# EAGLE schematic Glasses (EAGLE 9.1.0)

## Sheet 1 of 9
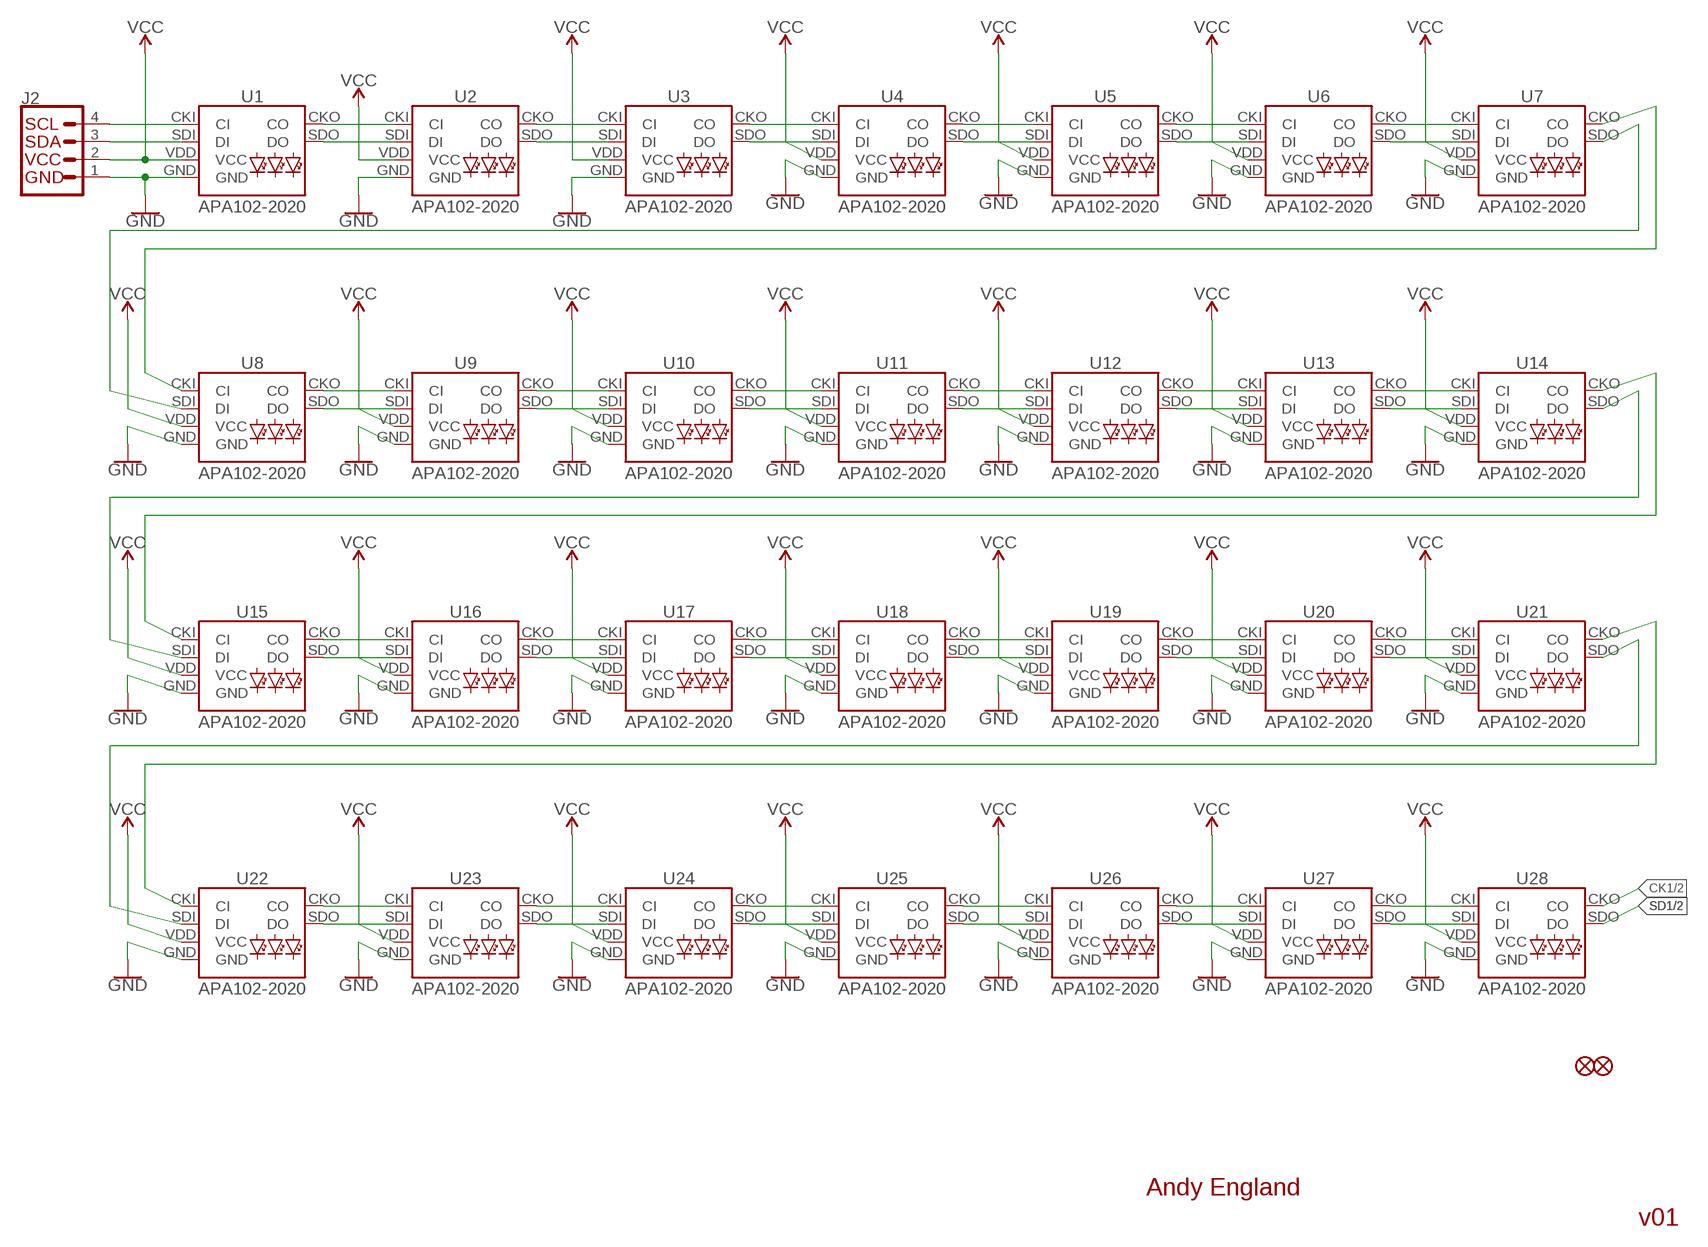
[diagram p0: schematic, sheet 1]

### Parts
FD1  FIDUCIALUFIDUCIAL  [FIDUCIAL-MICRO]
FD2  FIDUCIALUFIDUCIAL  [FIDUCIAL-MICRO]
J2  QWIIC_CONNECTORJS-1MM  [1X04_1MM_RA]
U1  APA102-2020  [APA102-2020]
U2  APA102-2020  [APA102-2020]
U3  APA102-2020  [APA102-2020]
U4  APA102-2020  [APA102-2020]
U5  APA102-2020  [APA102-2020]
U6  APA102-2020  [APA102-2020]
U7  APA102-2020  [APA102-2020]
U8  APA102-2020  [APA102-2020]
U9  APA102-2020  [APA102-2020]
U10  APA102-2020  [APA102-2020]
U11  APA102-2020  [APA102-2020]
U12  APA102-2020  [APA102-2020]
U13  APA102-2020  [APA102-2020]
U14  APA102-2020  [APA102-2020]
U15  APA102-2020  [APA102-2020]
U16  APA102-2020  [APA102-2020]
U17  APA102-2020  [APA102-2020]
U18  APA102-2020  [APA102-2020]
U19  APA102-2020  [APA102-2020]
U20  APA102-2020  [APA102-2020]
U21  APA102-2020  [APA102-2020]
U22  APA102-2020  [APA102-2020]
U23  APA102-2020  [APA102-2020]
U24  APA102-2020  [APA102-2020]
U25  APA102-2020  [APA102-2020]
U26  APA102-2020  [APA102-2020]
U27  APA102-2020  [APA102-2020]
U28  APA102-2020  [APA102-2020]

### Nets
CK1: U28.CKO(CO) ; also sheet 2
GND: J2.1 U1.GND U2.GND U3.GND U4.GND U5.GND U6.GND U7.GND U8.GND U9.GND U10.GND U11.GND U12.GND U13.GND U14.GND U15.GND U16.GND U17.GND U18.GND U19.GND U20.GND U21.GND U22.GND U23.GND U24.GND U25.GND U26.GND U27.GND U28.GND ; also sheet 2,3,4,5,6,7,8,9
N$1: U1.SDO(DO) U2.SDI(DI)
N$2: U1.CKO(CO) U2.CKI(CI)
N$3: U2.CKO(CO) U3.CKI(CI)
N$4: U2.SDO(DO) U3.SDI(DI)
N$5: U3.SDO(DO) U4.SDI(DI)
N$6: U3.CKO(CO) U4.CKI(CI)
N$7: U4.CKO(CO) U5.CKI(CI)
N$8: U4.SDO(DO) U5.SDI(DI)
N$9: U5.CKO(CO) U6.CKI(CI)
N$10: U5.SDO(DO) U6.SDI(DI)
N$11: U6.CKO(CO) U7.CKI(CI)
N$12: U6.SDO(DO) U7.SDI(DI)
N$13: U8.SDO(DO) U9.SDI(DI)
N$14: U8.CKO(CO) U9.CKI(CI)
N$15: U9.CKO(CO) U10.CKI(CI)
N$16: U9.SDO(DO) U10.SDI(DI)
N$17: U10.SDO(DO) U11.SDI(DI)
N$18: U10.CKO(CO) U11.CKI(CI)
N$19: U11.CKO(CO) U12.CKI(CI)
N$20: U11.SDO(DO) U12.SDI(DI)
N$21: U12.CKO(CO) U13.CKI(CI)
N$22: U12.SDO(DO) U13.SDI(DI)
N$23: U13.CKO(CO) U14.CKI(CI)
N$24: U13.SDO(DO) U14.SDI(DI)
N$25: U7.SDO(DO) U8.SDI(DI)
N$26: U7.CKO(CO) U8.CKI(CI)
N$27: U15.SDO(DO) U16.SDI(DI)
N$28: U15.CKO(CO) U16.CKI(CI)
N$29: U16.CKO(CO) U17.CKI(CI)
N$30: U16.SDO(DO) U17.SDI(DI)
N$31: U17.SDO(DO) U18.SDI(DI)
N$32: U17.CKO(CO) U18.CKI(CI)
N$33: U18.CKO(CO) U19.CKI(CI)
N$34: U18.SDO(DO) U19.SDI(DI)
N$35: U19.CKO(CO) U20.CKI(CI)
N$36: U19.SDO(DO) U20.SDI(DI)
N$37: U20.CKO(CO) U21.CKI(CI)
N$38: U20.SDO(DO) U21.SDI(DI)
N$39: U22.SDO(DO) U23.SDI(DI)
N$40: U22.CKO(CO) U23.CKI(CI)
N$41: U23.CKO(CO) U24.CKI(CI)
N$42: U23.SDO(DO) U24.SDI(DI)
N$43: U24.SDO(DO) U25.SDI(DI)
N$44: U24.CKO(CO) U25.CKI(CI)
N$45: U25.CKO(CO) U26.CKI(CI)
N$46: U25.SDO(DO) U26.SDI(DI)
N$47: U26.CKO(CO) U27.CKI(CI)
N$48: U26.SDO(DO) U27.SDI(DI)
N$49: U27.CKO(CO) U28.CKI(CI)
N$50: U27.SDO(DO) U28.SDI(DI)
N$51: U21.SDO(DO) U22.SDI(DI)
N$52: U21.CKO(CO) U22.CKI(CI)
N$53: U14.SDO(DO) U15.SDI(DI)
N$54: U14.CKO(CO) U15.CKI(CI)
N$270: J2.3 U1.SDI(DI)
N$490: J2.4 U1.CKI(CI)
SD1: U28.SDO(DO) ; also sheet 2
VCC: J2.2 U1.VDD(VCC) U2.VDD(VCC) U3.VDD(VCC) U4.VDD(VCC) U5.VDD(VCC) U6.VDD(VCC) U7.VDD(VCC) U8.VDD(VCC) U9.VDD(VCC) U10.VDD(VCC) U11.VDD(VCC) U12.VDD(VCC) U13.VDD(VCC) U14.VDD(VCC) U15.VDD(VCC) U16.VDD(VCC) U17.VDD(VCC) U18.VDD(VCC) U19.VDD(VCC) U20.VDD(VCC) U21.VDD(VCC) U22.VDD(VCC) U23.VDD(VCC) U24.VDD(VCC) U25.VDD(VCC) U26.VDD(VCC) U27.VDD(VCC) U28.VDD(VCC) ; also sheet 2,3,4,5,6,7,8,9

### Notes on the sheet
- Andy England
- v01

## Sheet 2 of 9
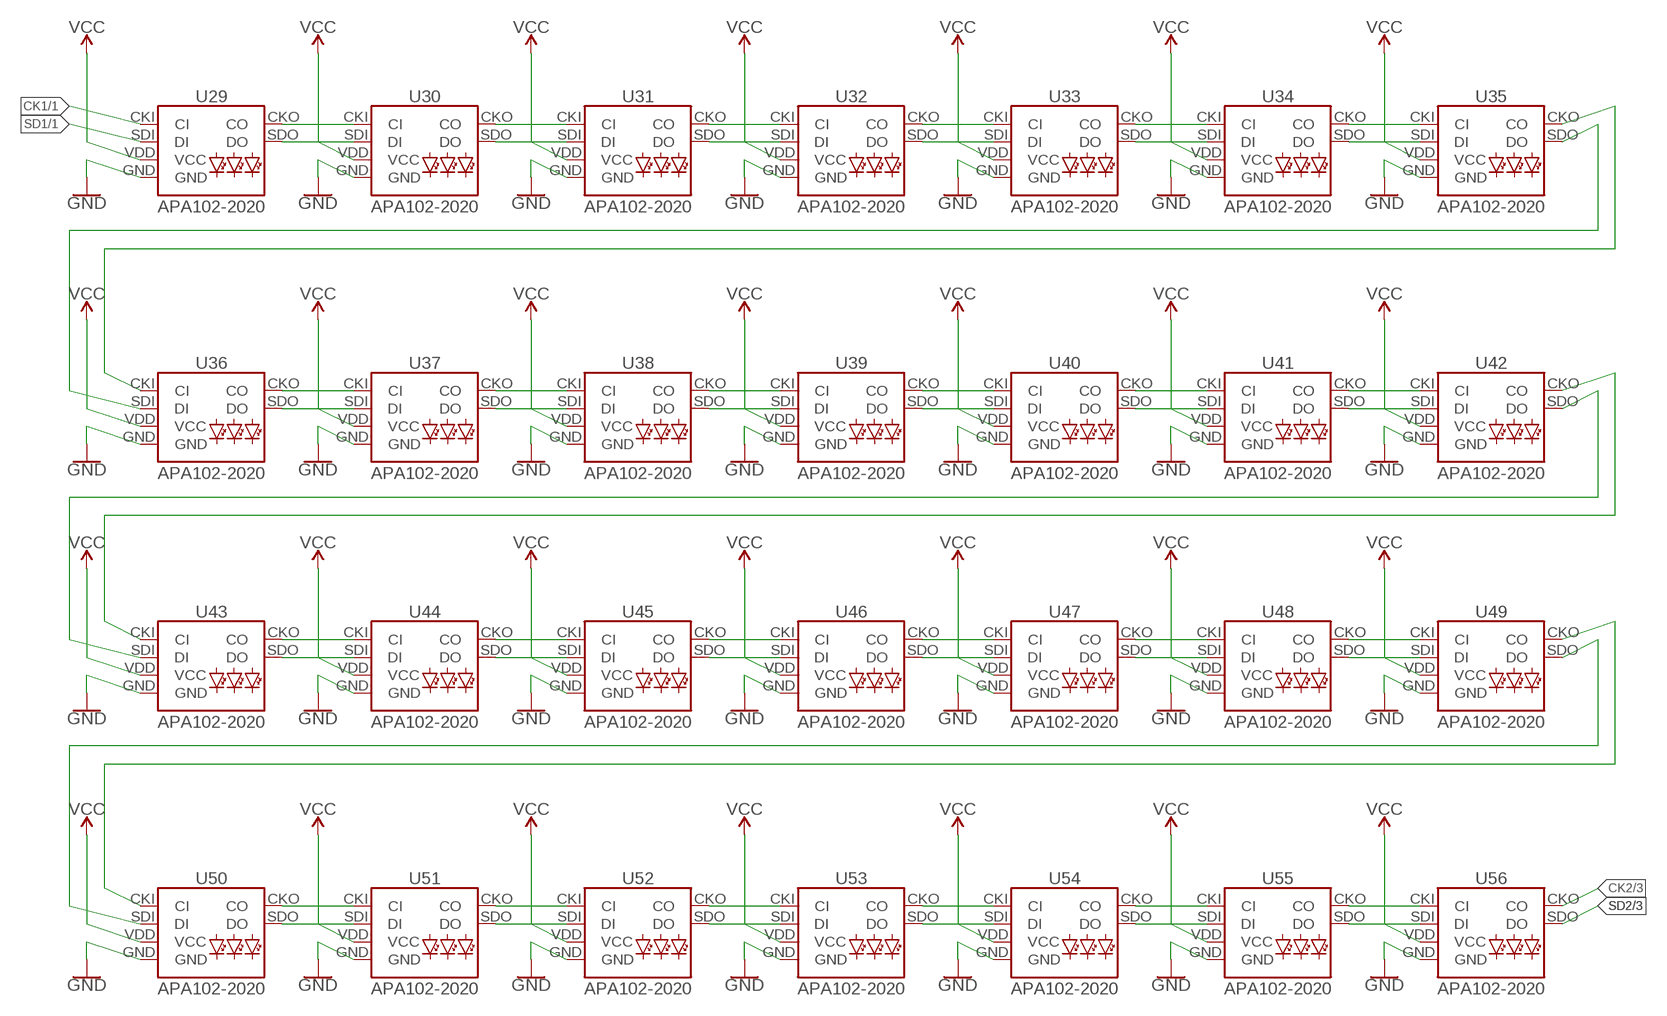
[diagram p1: schematic, sheet 2]

### Parts
U29  APA102-2020  [APA102-2020]
U30  APA102-2020  [APA102-2020]
U31  APA102-2020  [APA102-2020]
U32  APA102-2020  [APA102-2020]
U33  APA102-2020  [APA102-2020]
U34  APA102-2020  [APA102-2020]
U35  APA102-2020  [APA102-2020]
U36  APA102-2020  [APA102-2020]
U37  APA102-2020  [APA102-2020]
U38  APA102-2020  [APA102-2020]
U39  APA102-2020  [APA102-2020]
U40  APA102-2020  [APA102-2020]
U41  APA102-2020  [APA102-2020]
U42  APA102-2020  [APA102-2020]
U43  APA102-2020  [APA102-2020]
U44  APA102-2020  [APA102-2020]
U45  APA102-2020  [APA102-2020]
U46  APA102-2020  [APA102-2020]
U47  APA102-2020  [APA102-2020]
U48  APA102-2020  [APA102-2020]
U49  APA102-2020  [APA102-2020]
U50  APA102-2020  [APA102-2020]
U51  APA102-2020  [APA102-2020]
U52  APA102-2020  [APA102-2020]
U53  APA102-2020  [APA102-2020]
U54  APA102-2020  [APA102-2020]
U55  APA102-2020  [APA102-2020]
U56  APA102-2020  [APA102-2020]

### Nets
CK1: U29.CKI(CI) ; also sheet 1
CK2: U56.CKO(CO) ; also sheet 3
GND: U29.GND U30.GND U31.GND U32.GND U33.GND U34.GND U35.GND U36.GND U37.GND U38.GND U39.GND U40.GND U41.GND U42.GND U43.GND U44.GND U45.GND U46.GND U47.GND U48.GND U49.GND U50.GND U51.GND U52.GND U53.GND U54.GND U55.GND U56.GND ; also sheet 1,3,4,5,6,7,8,9
N$55: U29.SDO(DO) U30.SDI(DI)
N$56: U29.CKO(CO) U30.CKI(CI)
N$57: U30.CKO(CO) U31.CKI(CI)
N$58: U30.SDO(DO) U31.SDI(DI)
N$59: U31.SDO(DO) U32.SDI(DI)
N$60: U31.CKO(CO) U32.CKI(CI)
N$61: U32.CKO(CO) U33.CKI(CI)
N$62: U32.SDO(DO) U33.SDI(DI)
N$63: U33.CKO(CO) U34.CKI(CI)
N$64: U33.SDO(DO) U34.SDI(DI)
N$65: U34.CKO(CO) U35.CKI(CI)
N$66: U34.SDO(DO) U35.SDI(DI)
N$67: U36.SDO(DO) U37.SDI(DI)
N$68: U36.CKO(CO) U37.CKI(CI)
N$69: U37.CKO(CO) U38.CKI(CI)
N$70: U37.SDO(DO) U38.SDI(DI)
N$71: U38.SDO(DO) U39.SDI(DI)
N$72: U38.CKO(CO) U39.CKI(CI)
N$73: U39.CKO(CO) U40.CKI(CI)
N$74: U39.SDO(DO) U40.SDI(DI)
N$75: U40.CKO(CO) U41.CKI(CI)
N$76: U40.SDO(DO) U41.SDI(DI)
N$77: U41.CKO(CO) U42.CKI(CI)
N$78: U41.SDO(DO) U42.SDI(DI)
N$79: U35.SDO(DO) U36.SDI(DI)
N$80: U35.CKO(CO) U36.CKI(CI)
N$81: U43.SDO(DO) U44.SDI(DI)
N$82: U43.CKO(CO) U44.CKI(CI)
N$83: U44.CKO(CO) U45.CKI(CI)
N$84: U44.SDO(DO) U45.SDI(DI)
N$85: U45.SDO(DO) U46.SDI(DI)
N$86: U45.CKO(CO) U46.CKI(CI)
N$87: U46.CKO(CO) U47.CKI(CI)
N$88: U46.SDO(DO) U47.SDI(DI)
N$89: U47.CKO(CO) U48.CKI(CI)
N$90: U47.SDO(DO) U48.SDI(DI)
N$91: U48.CKO(CO) U49.CKI(CI)
N$92: U48.SDO(DO) U49.SDI(DI)
N$93: U50.SDO(DO) U51.SDI(DI)
N$94: U50.CKO(CO) U51.CKI(CI)
N$95: U51.CKO(CO) U52.CKI(CI)
N$96: U51.SDO(DO) U52.SDI(DI)
N$97: U52.SDO(DO) U53.SDI(DI)
N$98: U52.CKO(CO) U53.CKI(CI)
N$99: U53.CKO(CO) U54.CKI(CI)
N$100: U53.SDO(DO) U54.SDI(DI)
N$101: U54.CKO(CO) U55.CKI(CI)
N$102: U54.SDO(DO) U55.SDI(DI)
N$103: U55.CKO(CO) U56.CKI(CI)
N$104: U55.SDO(DO) U56.SDI(DI)
N$105: U49.SDO(DO) U50.SDI(DI)
N$106: U49.CKO(CO) U50.CKI(CI)
N$107: U42.SDO(DO) U43.SDI(DI)
N$108: U42.CKO(CO) U43.CKI(CI)
SD1: U29.SDI(DI) ; also sheet 1
SD2: U56.SDO(DO) ; also sheet 3
VCC: U29.VDD(VCC) U30.VDD(VCC) U31.VDD(VCC) U32.VDD(VCC) U33.VDD(VCC) U34.VDD(VCC) U35.VDD(VCC) U36.VDD(VCC) U37.VDD(VCC) U38.VDD(VCC) U39.VDD(VCC) U40.VDD(VCC) U41.VDD(VCC) U42.VDD(VCC) U43.VDD(VCC) U44.VDD(VCC) U45.VDD(VCC) U46.VDD(VCC) U47.VDD(VCC) U48.VDD(VCC) U49.VDD(VCC) U50.VDD(VCC) U51.VDD(VCC) U52.VDD(VCC) U53.VDD(VCC) U54.VDD(VCC) U55.VDD(VCC) U56.VDD(VCC) ; also sheet 1,3,4,5,6,7,8,9

## Sheet 3 of 9
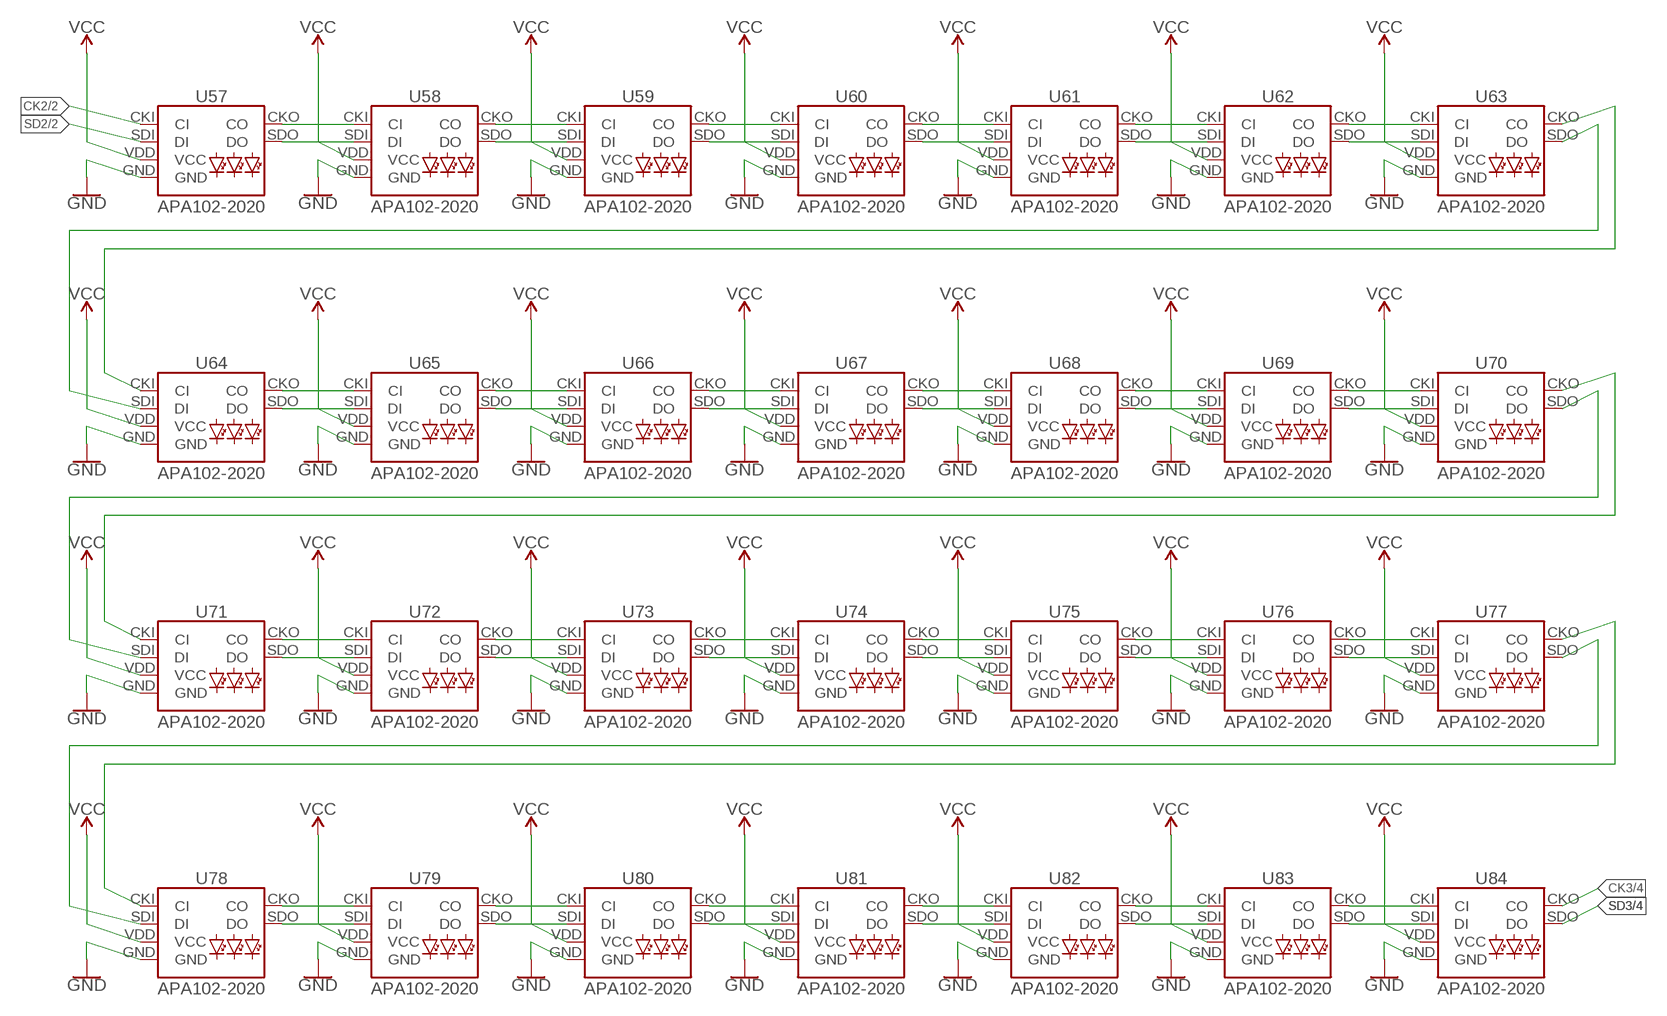
[diagram p2: schematic, sheet 3]

### Parts
U57  APA102-2020  [APA102-2020]
U58  APA102-2020  [APA102-2020]
U59  APA102-2020  [APA102-2020]
U60  APA102-2020  [APA102-2020]
U61  APA102-2020  [APA102-2020]
U62  APA102-2020  [APA102-2020]
U63  APA102-2020  [APA102-2020]
U64  APA102-2020  [APA102-2020]
U65  APA102-2020  [APA102-2020]
U66  APA102-2020  [APA102-2020]
U67  APA102-2020  [APA102-2020]
U68  APA102-2020  [APA102-2020]
U69  APA102-2020  [APA102-2020]
U70  APA102-2020  [APA102-2020]
U71  APA102-2020  [APA102-2020]
U72  APA102-2020  [APA102-2020]
U73  APA102-2020  [APA102-2020]
U74  APA102-2020  [APA102-2020]
U75  APA102-2020  [APA102-2020]
U76  APA102-2020  [APA102-2020]
U77  APA102-2020  [APA102-2020]
U78  APA102-2020  [APA102-2020]
U79  APA102-2020  [APA102-2020]
U80  APA102-2020  [APA102-2020]
U81  APA102-2020  [APA102-2020]
U82  APA102-2020  [APA102-2020]
U83  APA102-2020  [APA102-2020]
U84  APA102-2020  [APA102-2020]

### Nets
CK2: U57.CKI(CI) ; also sheet 2
CK3: U84.CKO(CO) ; also sheet 4
GND: U57.GND U58.GND U59.GND U60.GND U61.GND U62.GND U63.GND U64.GND U65.GND U66.GND U67.GND U68.GND U69.GND U70.GND U71.GND U72.GND U73.GND U74.GND U75.GND U76.GND U77.GND U78.GND U79.GND U80.GND U81.GND U82.GND U83.GND U84.GND ; also sheet 1,2,4,5,6,7,8,9
N$109: U57.SDO(DO) U58.SDI(DI)
N$110: U57.CKO(CO) U58.CKI(CI)
N$111: U58.CKO(CO) U59.CKI(CI)
N$112: U58.SDO(DO) U59.SDI(DI)
N$113: U59.SDO(DO) U60.SDI(DI)
N$114: U59.CKO(CO) U60.CKI(CI)
N$115: U60.CKO(CO) U61.CKI(CI)
N$116: U60.SDO(DO) U61.SDI(DI)
N$117: U61.CKO(CO) U62.CKI(CI)
N$118: U61.SDO(DO) U62.SDI(DI)
N$119: U62.CKO(CO) U63.CKI(CI)
N$120: U62.SDO(DO) U63.SDI(DI)
N$121: U64.SDO(DO) U65.SDI(DI)
N$122: U64.CKO(CO) U65.CKI(CI)
N$123: U65.CKO(CO) U66.CKI(CI)
N$124: U65.SDO(DO) U66.SDI(DI)
N$125: U66.SDO(DO) U67.SDI(DI)
N$126: U66.CKO(CO) U67.CKI(CI)
N$127: U67.CKO(CO) U68.CKI(CI)
N$128: U67.SDO(DO) U68.SDI(DI)
N$129: U68.CKO(CO) U69.CKI(CI)
N$130: U68.SDO(DO) U69.SDI(DI)
N$131: U69.CKO(CO) U70.CKI(CI)
N$132: U69.SDO(DO) U70.SDI(DI)
N$133: U63.SDO(DO) U64.SDI(DI)
N$134: U63.CKO(CO) U64.CKI(CI)
N$135: U71.SDO(DO) U72.SDI(DI)
N$136: U71.CKO(CO) U72.CKI(CI)
N$137: U72.CKO(CO) U73.CKI(CI)
N$138: U72.SDO(DO) U73.SDI(DI)
N$139: U73.SDO(DO) U74.SDI(DI)
N$140: U73.CKO(CO) U74.CKI(CI)
N$141: U74.CKO(CO) U75.CKI(CI)
N$142: U74.SDO(DO) U75.SDI(DI)
N$143: U75.CKO(CO) U76.CKI(CI)
N$144: U75.SDO(DO) U76.SDI(DI)
N$145: U76.CKO(CO) U77.CKI(CI)
N$146: U76.SDO(DO) U77.SDI(DI)
N$147: U78.SDO(DO) U79.SDI(DI)
N$148: U78.CKO(CO) U79.CKI(CI)
N$149: U79.CKO(CO) U80.CKI(CI)
N$150: U79.SDO(DO) U80.SDI(DI)
N$151: U80.SDO(DO) U81.SDI(DI)
N$152: U80.CKO(CO) U81.CKI(CI)
N$153: U81.CKO(CO) U82.CKI(CI)
N$154: U81.SDO(DO) U82.SDI(DI)
N$155: U82.CKO(CO) U83.CKI(CI)
N$156: U82.SDO(DO) U83.SDI(DI)
N$157: U83.CKO(CO) U84.CKI(CI)
N$158: U83.SDO(DO) U84.SDI(DI)
N$159: U77.SDO(DO) U78.SDI(DI)
N$160: U77.CKO(CO) U78.CKI(CI)
N$161: U70.SDO(DO) U71.SDI(DI)
N$162: U70.CKO(CO) U71.CKI(CI)
SD2: U57.SDI(DI) ; also sheet 2
SD3: U84.SDO(DO) ; also sheet 4
VCC: U57.VDD(VCC) U58.VDD(VCC) U59.VDD(VCC) U60.VDD(VCC) U61.VDD(VCC) U62.VDD(VCC) U63.VDD(VCC) U64.VDD(VCC) U65.VDD(VCC) U66.VDD(VCC) U67.VDD(VCC) U68.VDD(VCC) U69.VDD(VCC) U70.VDD(VCC) U71.VDD(VCC) U72.VDD(VCC) U73.VDD(VCC) U74.VDD(VCC) U75.VDD(VCC) U76.VDD(VCC) U77.VDD(VCC) U78.VDD(VCC) U79.VDD(VCC) U80.VDD(VCC) U81.VDD(VCC) U82.VDD(VCC) U83.VDD(VCC) U84.VDD(VCC) ; also sheet 1,2,4,5,6,7,8,9

## Sheet 4 of 9
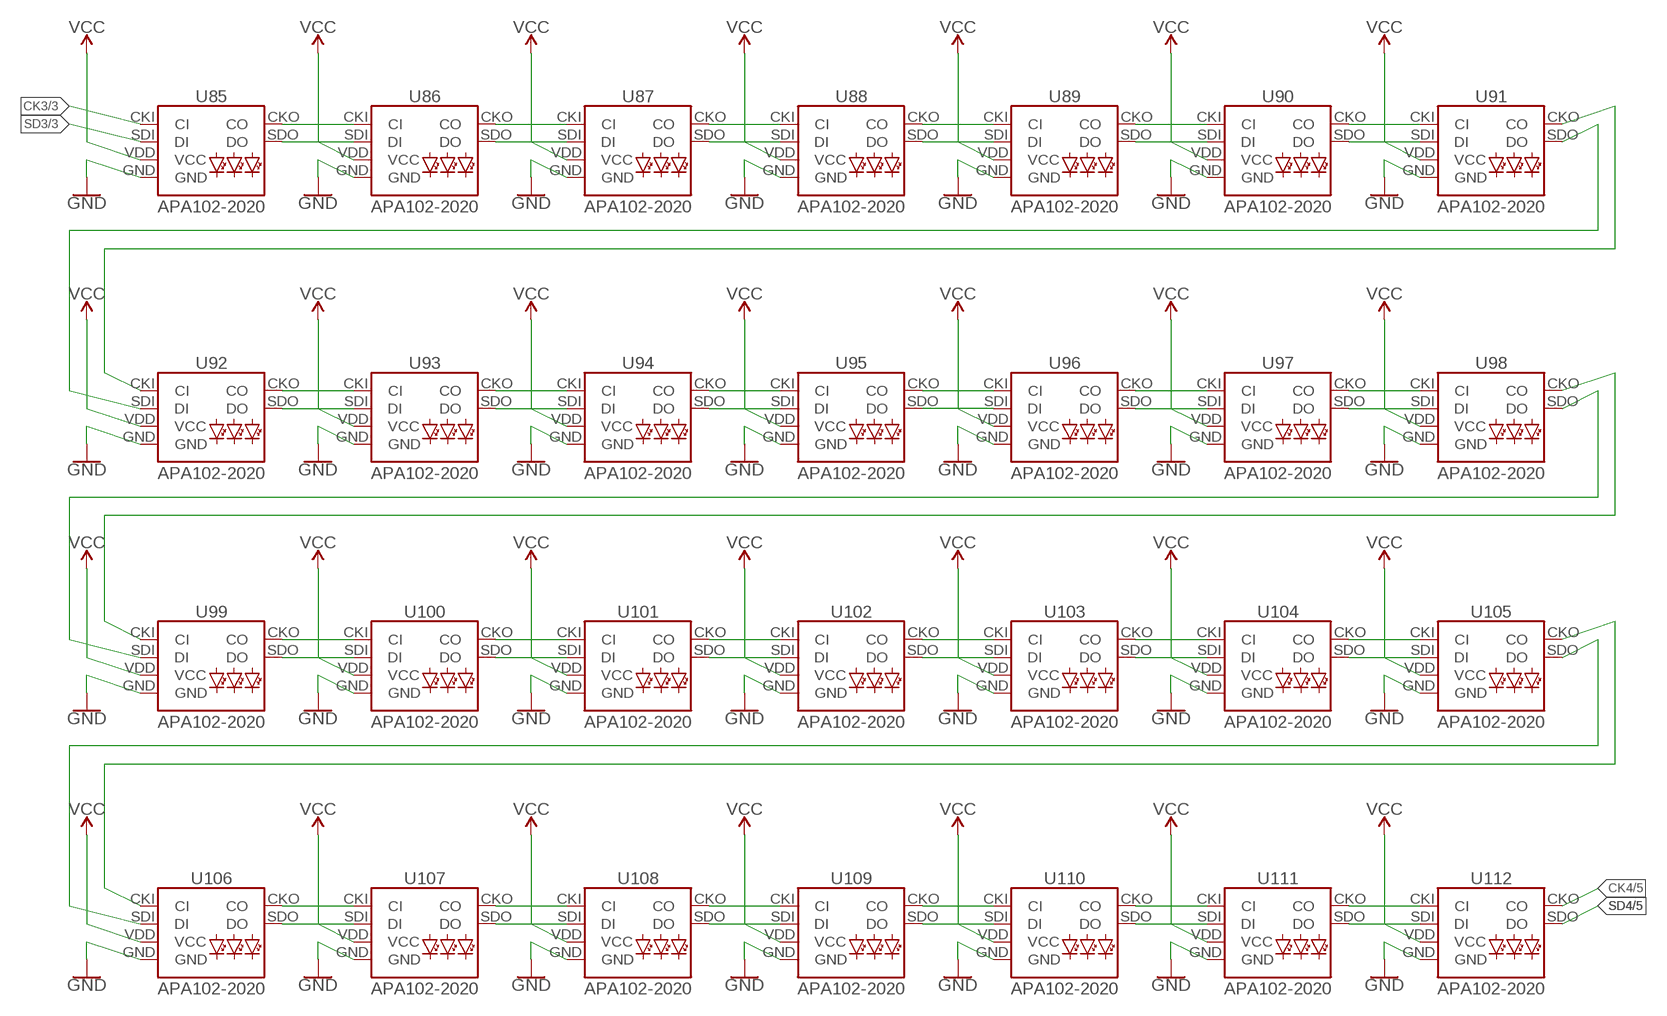
[diagram p3: schematic, sheet 4]

### Parts
U85  APA102-2020  [APA102-2020]
U86  APA102-2020  [APA102-2020]
U87  APA102-2020  [APA102-2020]
U88  APA102-2020  [APA102-2020]
U89  APA102-2020  [APA102-2020]
U90  APA102-2020  [APA102-2020]
U91  APA102-2020  [APA102-2020]
U92  APA102-2020  [APA102-2020]
U93  APA102-2020  [APA102-2020]
U94  APA102-2020  [APA102-2020]
U95  APA102-2020  [APA102-2020]
U96  APA102-2020  [APA102-2020]
U97  APA102-2020  [APA102-2020]
U98  APA102-2020  [APA102-2020]
U99  APA102-2020  [APA102-2020]
U100  APA102-2020  [APA102-2020]
U101  APA102-2020  [APA102-2020]
U102  APA102-2020  [APA102-2020]
U103  APA102-2020  [APA102-2020]
U104  APA102-2020  [APA102-2020]
U105  APA102-2020  [APA102-2020]
U106  APA102-2020  [APA102-2020]
U107  APA102-2020  [APA102-2020]
U108  APA102-2020  [APA102-2020]
U109  APA102-2020  [APA102-2020]
U110  APA102-2020  [APA102-2020]
U111  APA102-2020  [APA102-2020]
U112  APA102-2020  [APA102-2020]

### Nets
CK3: U85.CKI(CI) ; also sheet 3
CK4: U112.CKO(CO) ; also sheet 5
GND: U85.GND U86.GND U87.GND U88.GND U89.GND U90.GND U91.GND U92.GND U93.GND U94.GND U95.GND U96.GND U97.GND U98.GND U99.GND U100.GND U101.GND U102.GND U103.GND U104.GND U105.GND U106.GND U107.GND U108.GND U109.GND U110.GND U111.GND U112.GND ; also sheet 1,2,3,5,6,7,8,9
N$163: U85.SDO(DO) U86.SDI(DI)
N$164: U85.CKO(CO) U86.CKI(CI)
N$165: U86.CKO(CO) U87.CKI(CI)
N$166: U86.SDO(DO) U87.SDI(DI)
N$167: U87.SDO(DO) U88.SDI(DI)
N$168: U87.CKO(CO) U88.CKI(CI)
N$169: U88.CKO(CO) U89.CKI(CI)
N$170: U88.SDO(DO) U89.SDI(DI)
N$171: U89.CKO(CO) U90.CKI(CI)
N$172: U89.SDO(DO) U90.SDI(DI)
N$173: U90.CKO(CO) U91.CKI(CI)
N$174: U90.SDO(DO) U91.SDI(DI)
N$175: U92.SDO(DO) U93.SDI(DI)
N$176: U92.CKO(CO) U93.CKI(CI)
N$177: U93.CKO(CO) U94.CKI(CI)
N$178: U93.SDO(DO) U94.SDI(DI)
N$179: U94.SDO(DO) U95.SDI(DI)
N$180: U94.CKO(CO) U95.CKI(CI)
N$181: U95.SDO(DO) U96.SDI(DI)
N$182: U95.CKO(CO) U96.CKI(CI)
N$183: U96.CKO(CO) U97.CKI(CI)
N$184: U96.SDO(DO) U97.SDI(DI)
N$185: U97.CKO(CO) U98.CKI(CI)
N$186: U97.SDO(DO) U98.SDI(DI)
N$187: U91.SDO(DO) U92.SDI(DI)
N$188: U91.CKO(CO) U92.CKI(CI)
N$189: U99.SDO(DO) U100.SDI(DI)
N$190: U99.CKO(CO) U100.CKI(CI)
N$191: U100.CKO(CO) U101.CKI(CI)
N$192: U100.SDO(DO) U101.SDI(DI)
N$193: U101.SDO(DO) U102.SDI(DI)
N$194: U101.CKO(CO) U102.CKI(CI)
N$195: U102.CKO(CO) U103.CKI(CI)
N$196: U102.SDO(DO) U103.SDI(DI)
N$197: U103.CKO(CO) U104.CKI(CI)
N$198: U103.SDO(DO) U104.SDI(DI)
N$199: U104.CKO(CO) U105.CKI(CI)
N$200: U104.SDO(DO) U105.SDI(DI)
N$201: U106.SDO(DO) U107.SDI(DI)
N$202: U106.CKO(CO) U107.CKI(CI)
N$203: U107.CKO(CO) U108.CKI(CI)
N$204: U107.SDO(DO) U108.SDI(DI)
N$205: U108.SDO(DO) U109.SDI(DI)
N$206: U108.CKO(CO) U109.CKI(CI)
N$207: U109.CKO(CO) U110.CKI(CI)
N$208: U109.SDO(DO) U110.SDI(DI)
N$209: U110.CKO(CO) U111.CKI(CI)
N$210: U110.SDO(DO) U111.SDI(DI)
N$211: U111.CKO(CO) U112.CKI(CI)
N$212: U111.SDO(DO) U112.SDI(DI)
N$213: U105.SDO(DO) U106.SDI(DI)
N$214: U105.CKO(CO) U106.CKI(CI)
N$215: U98.SDO(DO) U99.SDI(DI)
N$216: U98.CKO(CO) U99.CKI(CI)
SD3: U85.SDI(DI) ; also sheet 3
SD4: U112.SDO(DO) ; also sheet 5
VCC: U85.VDD(VCC) U86.VDD(VCC) U87.VDD(VCC) U88.VDD(VCC) U89.VDD(VCC) U90.VDD(VCC) U91.VDD(VCC) U92.VDD(VCC) U93.VDD(VCC) U94.VDD(VCC) U95.VDD(VCC) U96.VDD(VCC) U97.VDD(VCC) U98.VDD(VCC) U99.VDD(VCC) U100.VDD(VCC) U101.VDD(VCC) U102.VDD(VCC) U103.VDD(VCC) U104.VDD(VCC) U105.VDD(VCC) U106.VDD(VCC) U107.VDD(VCC) U108.VDD(VCC) U109.VDD(VCC) U110.VDD(VCC) U111.VDD(VCC) U112.VDD(VCC) ; also sheet 1,2,3,5,6,7,8,9

## Sheet 5 of 9
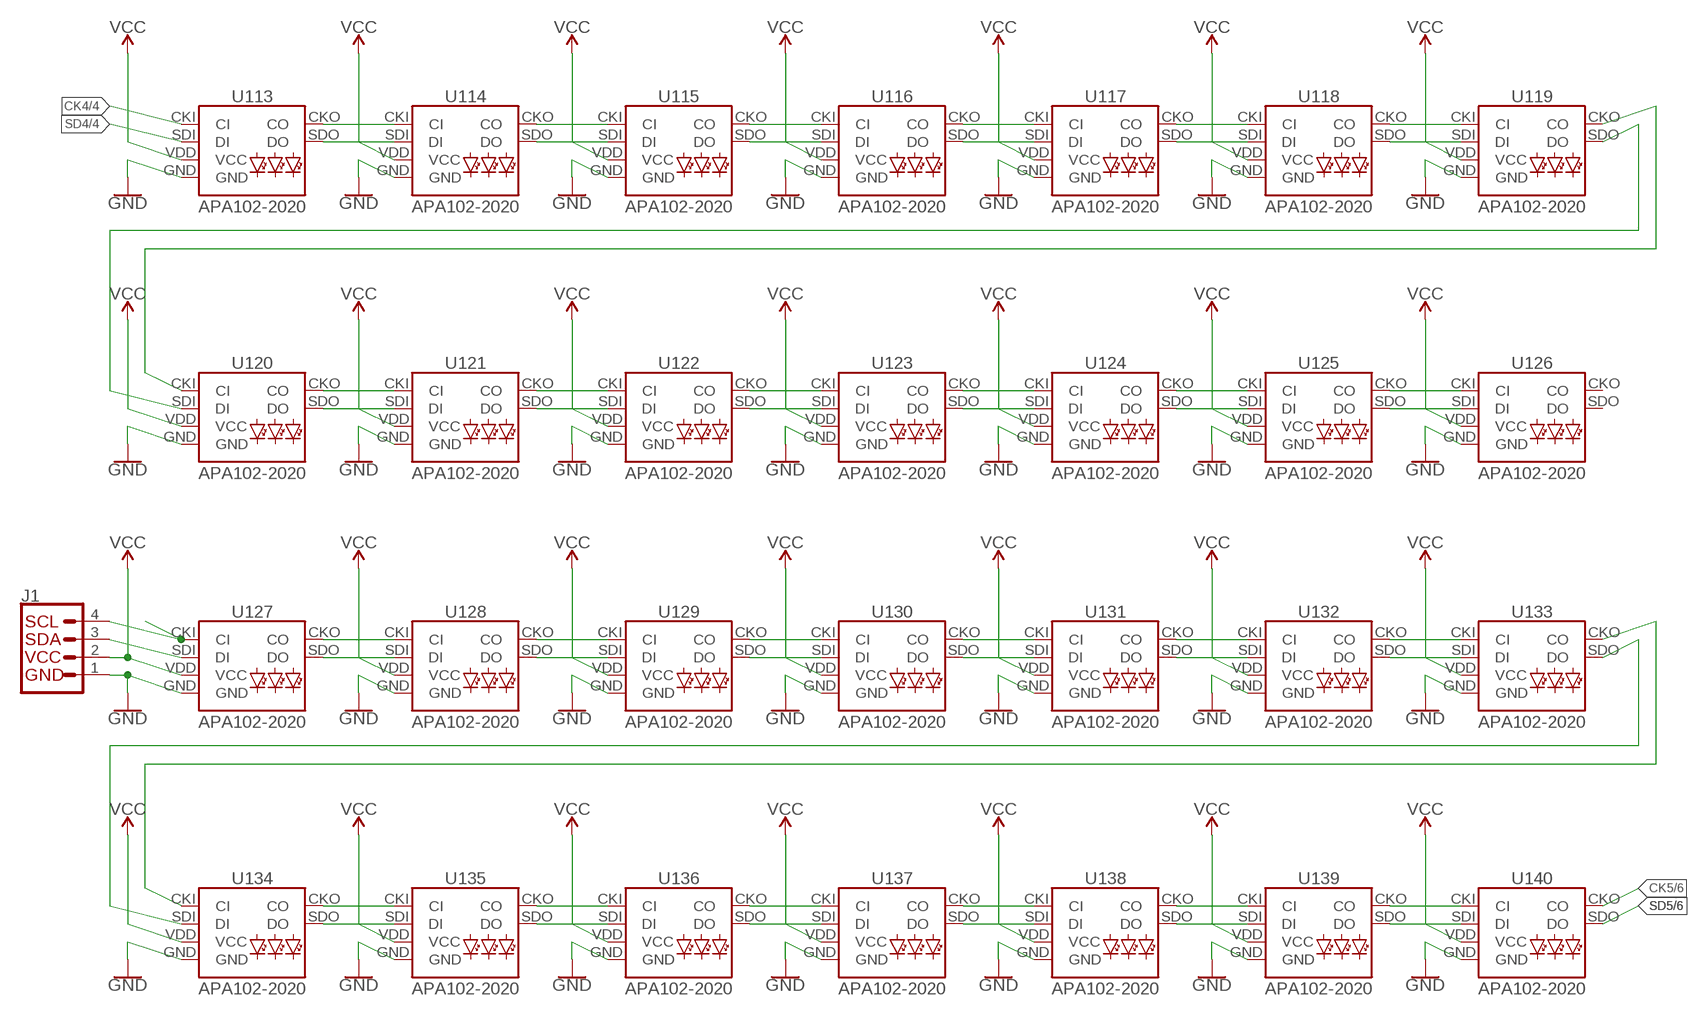
[diagram p4: schematic, sheet 5]

### Parts
J1  QWIIC_CONNECTORJS-1MM  [1X04_1MM_RA]
U113  APA102-2020  [APA102-2020]
U114  APA102-2020  [APA102-2020]
U115  APA102-2020  [APA102-2020]
U116  APA102-2020  [APA102-2020]
U117  APA102-2020  [APA102-2020]
U118  APA102-2020  [APA102-2020]
U119  APA102-2020  [APA102-2020]
U120  APA102-2020  [APA102-2020]
U121  APA102-2020  [APA102-2020]
U122  APA102-2020  [APA102-2020]
U123  APA102-2020  [APA102-2020]
U124  APA102-2020  [APA102-2020]
U125  APA102-2020  [APA102-2020]
U126  APA102-2020  [APA102-2020]
U127  APA102-2020  [APA102-2020]
U128  APA102-2020  [APA102-2020]
U129  APA102-2020  [APA102-2020]
U130  APA102-2020  [APA102-2020]
U131  APA102-2020  [APA102-2020]
U132  APA102-2020  [APA102-2020]
U133  APA102-2020  [APA102-2020]
U134  APA102-2020  [APA102-2020]
U135  APA102-2020  [APA102-2020]
U136  APA102-2020  [APA102-2020]
U137  APA102-2020  [APA102-2020]
U138  APA102-2020  [APA102-2020]
U139  APA102-2020  [APA102-2020]
U140  APA102-2020  [APA102-2020]

### Nets
CK4: U113.CKI(CI) ; also sheet 4
CK5: U140.CKO(CO) ; also sheet 6
GND: J1.1 U113.GND U114.GND U115.GND U116.GND U117.GND U118.GND U119.GND U120.GND U121.GND U122.GND U123.GND U124.GND U125.GND U126.GND U127.GND U128.GND U129.GND U130.GND U131.GND U132.GND U133.GND U134.GND U135.GND U136.GND U137.GND U138.GND U139.GND U140.GND ; also sheet 1,2,3,4,6,7,8,9
N$217: U113.SDO(DO) U114.SDI(DI)
N$218: U113.CKO(CO) U114.CKI(CI)
N$219: U114.CKO(CO) U115.CKI(CI)
N$220: U114.SDO(DO) U115.SDI(DI)
N$221: U115.SDO(DO) U116.SDI(DI)
N$222: U115.CKO(CO) U116.CKI(CI)
N$223: U116.CKO(CO) U117.CKI(CI)
N$224: U116.SDO(DO) U117.SDI(DI)
N$225: U117.CKO(CO) U118.CKI(CI)
N$226: U117.SDO(DO) U118.SDI(DI)
N$227: U118.CKO(CO) U119.CKI(CI)
N$228: U118.SDO(DO) U119.SDI(DI)
N$229: U120.SDO(DO) U121.SDI(DI)
N$230: U120.CKO(CO) U121.CKI(CI)
N$231: U121.CKO(CO) U122.CKI(CI)
N$232: U121.SDO(DO) U122.SDI(DI)
N$233: U122.SDO(DO) U123.SDI(DI)
N$234: U122.CKO(CO) U123.CKI(CI)
N$235: U123.CKO(CO) U124.CKI(CI)
N$236: U123.SDO(DO) U124.SDI(DI)
N$237: U124.CKO(CO) U125.CKI(CI)
N$238: U124.SDO(DO) U125.SDI(DI)
N$239: U125.CKO(CO) U126.CKI(CI)
N$240: U125.SDO(DO) U126.SDI(DI)
N$241: U119.SDO(DO) U120.SDI(DI)
N$242: U119.CKO(CO) U120.CKI(CI)
N$243: U127.SDO(DO) U128.SDI(DI)
N$244: U127.CKO(CO) U128.CKI(CI)
N$245: U128.CKO(CO) U129.CKI(CI)
N$246: U128.SDO(DO) U129.SDI(DI)
N$247: U129.SDO(DO) U130.SDI(DI)
N$248: U129.CKO(CO) U130.CKI(CI)
N$249: U130.CKO(CO) U131.CKI(CI)
N$250: U130.SDO(DO) U131.SDI(DI)
N$251: U131.CKO(CO) U132.CKI(CI)
N$252: U131.SDO(DO) U132.SDI(DI)
N$253: U132.CKO(CO) U133.CKI(CI)
N$254: U132.SDO(DO) U133.SDI(DI)
N$255: U134.SDO(DO) U135.SDI(DI)
N$256: U134.CKO(CO) U135.CKI(CI)
N$257: U135.CKO(CO) U136.CKI(CI)
N$258: U135.SDO(DO) U136.SDI(DI)
N$259: U136.SDO(DO) U137.SDI(DI)
N$260: U136.CKO(CO) U137.CKI(CI)
N$261: U137.CKO(CO) U138.CKI(CI)
N$262: U137.SDO(DO) U138.SDI(DI)
N$263: U138.CKO(CO) U139.CKI(CI)
N$264: U138.SDO(DO) U139.SDI(DI)
N$265: U139.CKO(CO) U140.CKI(CI)
N$266: U139.SDO(DO) U140.SDI(DI)
N$267: U133.SDO(DO) U134.SDI(DI)
N$268: U133.CKO(CO) U134.CKI(CI)
N$269: J1.3 U127.SDI(DI)
N$489: J1.4 U127.CKI(CI)
SD4: U113.SDI(DI) ; also sheet 4
SD5: U140.SDO(DO) ; also sheet 6
VCC: J1.2 U113.VDD(VCC) U114.VDD(VCC) U115.VDD(VCC) U116.VDD(VCC) U117.VDD(VCC) U118.VDD(VCC) U119.VDD(VCC) U120.VDD(VCC) U121.VDD(VCC) U122.VDD(VCC) U123.VDD(VCC) U124.VDD(VCC) U125.VDD(VCC) U126.VDD(VCC) U127.VDD(VCC) U128.VDD(VCC) U129.VDD(VCC) U130.VDD(VCC) U131.VDD(VCC) U132.VDD(VCC) U133.VDD(VCC) U134.VDD(VCC) U135.VDD(VCC) U136.VDD(VCC) U137.VDD(VCC) U138.VDD(VCC) U139.VDD(VCC) U140.VDD(VCC) ; also sheet 1,2,3,4,6,7,8,9
Unconnected: U126.CKO(CO) U126.SDO(DO)

## Sheet 6 of 9
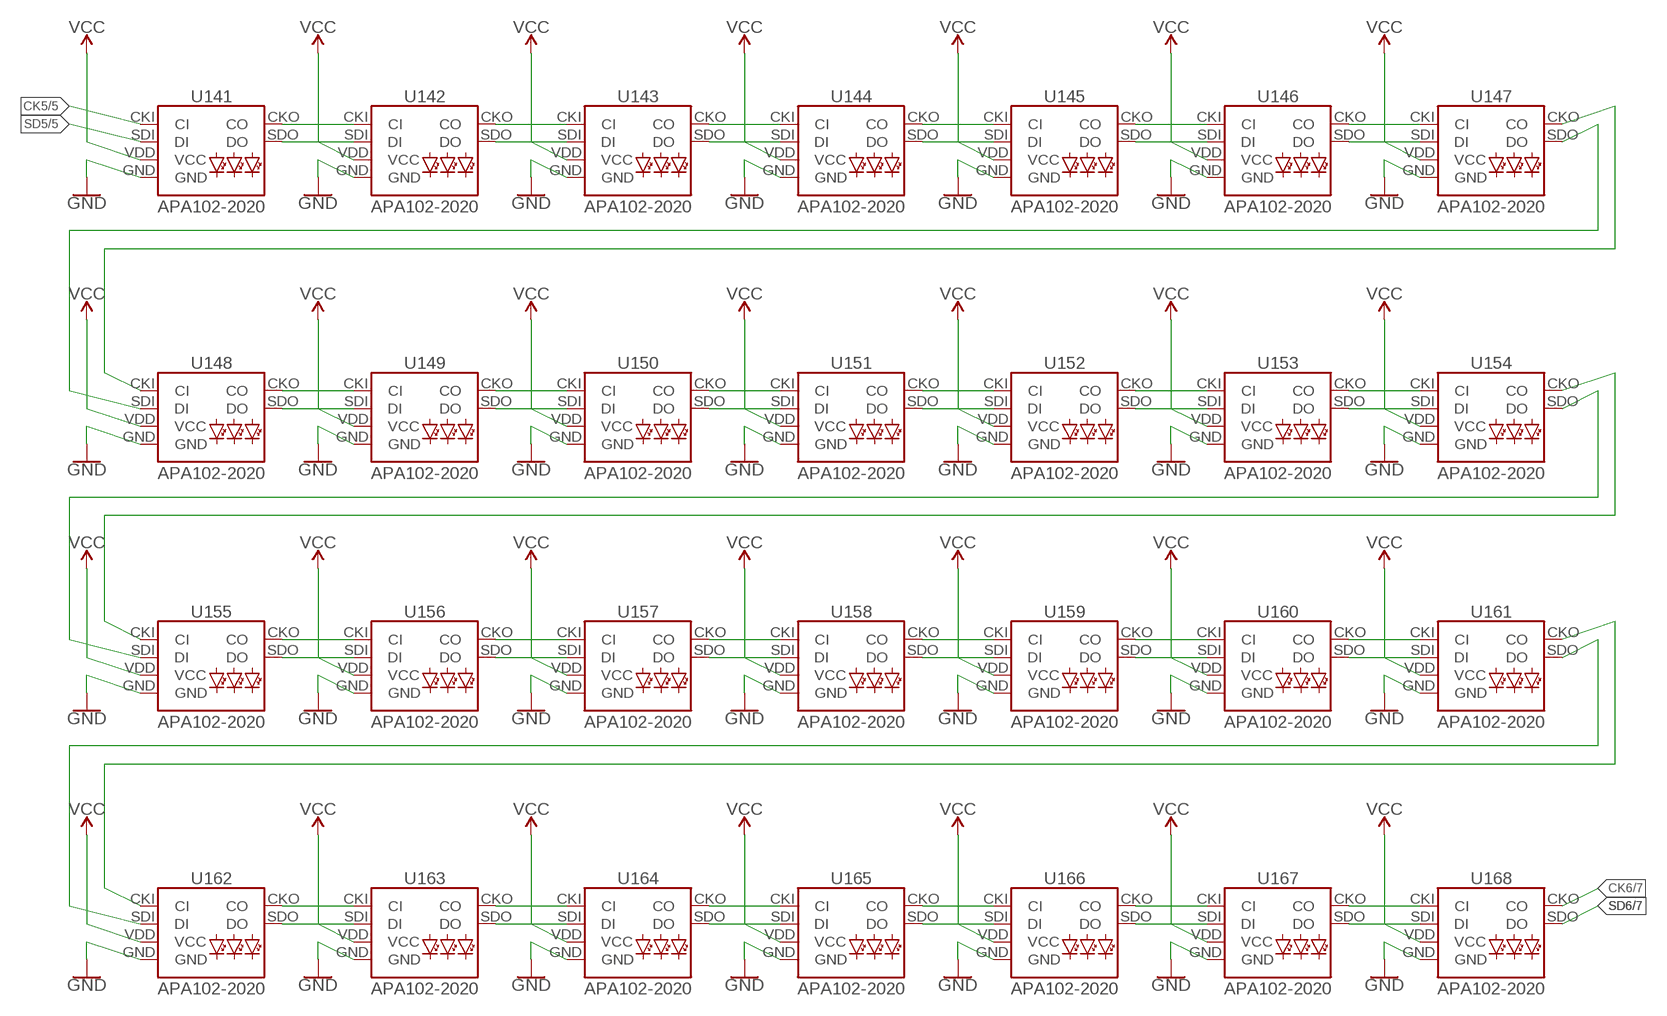
[diagram p5: schematic, sheet 6]

### Parts
U141  APA102-2020  [APA102-2020]
U142  APA102-2020  [APA102-2020]
U143  APA102-2020  [APA102-2020]
U144  APA102-2020  [APA102-2020]
U145  APA102-2020  [APA102-2020]
U146  APA102-2020  [APA102-2020]
U147  APA102-2020  [APA102-2020]
U148  APA102-2020  [APA102-2020]
U149  APA102-2020  [APA102-2020]
U150  APA102-2020  [APA102-2020]
U151  APA102-2020  [APA102-2020]
U152  APA102-2020  [APA102-2020]
U153  APA102-2020  [APA102-2020]
U154  APA102-2020  [APA102-2020]
U155  APA102-2020  [APA102-2020]
U156  APA102-2020  [APA102-2020]
U157  APA102-2020  [APA102-2020]
U158  APA102-2020  [APA102-2020]
U159  APA102-2020  [APA102-2020]
U160  APA102-2020  [APA102-2020]
U161  APA102-2020  [APA102-2020]
U162  APA102-2020  [APA102-2020]
U163  APA102-2020  [APA102-2020]
U164  APA102-2020  [APA102-2020]
U165  APA102-2020  [APA102-2020]
U166  APA102-2020  [APA102-2020]
U167  APA102-2020  [APA102-2020]
U168  APA102-2020  [APA102-2020]

### Nets
CK5: U141.CKI(CI) ; also sheet 5
CK6: U168.CKO(CO) ; also sheet 7
GND: U141.GND U142.GND U143.GND U144.GND U145.GND U146.GND U147.GND U148.GND U149.GND U150.GND U151.GND U152.GND U153.GND U154.GND U155.GND U156.GND U157.GND U158.GND U159.GND U160.GND U161.GND U162.GND U163.GND U164.GND U165.GND U166.GND U167.GND U168.GND ; also sheet 1,2,3,4,5,7,8,9
N$271: U141.SDO(DO) U142.SDI(DI)
N$272: U141.CKO(CO) U142.CKI(CI)
N$273: U142.CKO(CO) U143.CKI(CI)
N$274: U142.SDO(DO) U143.SDI(DI)
N$275: U143.SDO(DO) U144.SDI(DI)
N$276: U143.CKO(CO) U144.CKI(CI)
N$277: U144.CKO(CO) U145.CKI(CI)
N$278: U144.SDO(DO) U145.SDI(DI)
N$279: U145.CKO(CO) U146.CKI(CI)
N$280: U145.SDO(DO) U146.SDI(DI)
N$281: U146.CKO(CO) U147.CKI(CI)
N$282: U146.SDO(DO) U147.SDI(DI)
N$283: U148.SDO(DO) U149.SDI(DI)
N$284: U148.CKO(CO) U149.CKI(CI)
N$285: U149.CKO(CO) U150.CKI(CI)
N$286: U149.SDO(DO) U150.SDI(DI)
N$287: U150.SDO(DO) U151.SDI(DI)
N$288: U150.CKO(CO) U151.CKI(CI)
N$289: U151.CKO(CO) U152.CKI(CI)
N$290: U151.SDO(DO) U152.SDI(DI)
N$291: U152.CKO(CO) U153.CKI(CI)
N$292: U152.SDO(DO) U153.SDI(DI)
N$293: U153.CKO(CO) U154.CKI(CI)
N$294: U153.SDO(DO) U154.SDI(DI)
N$295: U147.SDO(DO) U148.SDI(DI)
N$296: U147.CKO(CO) U148.CKI(CI)
N$297: U155.SDO(DO) U156.SDI(DI)
N$298: U155.CKO(CO) U156.CKI(CI)
N$299: U156.CKO(CO) U157.CKI(CI)
N$300: U156.SDO(DO) U157.SDI(DI)
N$301: U157.SDO(DO) U158.SDI(DI)
N$302: U157.CKO(CO) U158.CKI(CI)
N$303: U158.CKO(CO) U159.CKI(CI)
N$304: U158.SDO(DO) U159.SDI(DI)
N$305: U159.CKO(CO) U160.CKI(CI)
N$306: U159.SDO(DO) U160.SDI(DI)
N$307: U160.CKO(CO) U161.CKI(CI)
N$308: U160.SDO(DO) U161.SDI(DI)
N$309: U162.SDO(DO) U163.SDI(DI)
N$310: U162.CKO(CO) U163.CKI(CI)
N$311: U163.CKO(CO) U164.CKI(CI)
N$312: U163.SDO(DO) U164.SDI(DI)
N$313: U164.SDO(DO) U165.SDI(DI)
N$314: U164.CKO(CO) U165.CKI(CI)
N$315: U165.CKO(CO) U166.CKI(CI)
N$316: U165.SDO(DO) U166.SDI(DI)
N$317: U166.CKO(CO) U167.CKI(CI)
N$318: U166.SDO(DO) U167.SDI(DI)
N$319: U167.CKO(CO) U168.CKI(CI)
N$320: U167.SDO(DO) U168.SDI(DI)
N$321: U161.SDO(DO) U162.SDI(DI)
N$322: U161.CKO(CO) U162.CKI(CI)
N$323: U154.SDO(DO) U155.SDI(DI)
N$324: U154.CKO(CO) U155.CKI(CI)
SD5: U141.SDI(DI) ; also sheet 5
SD6: U168.SDO(DO) ; also sheet 7
VCC: U141.VDD(VCC) U142.VDD(VCC) U143.VDD(VCC) U144.VDD(VCC) U145.VDD(VCC) U146.VDD(VCC) U147.VDD(VCC) U148.VDD(VCC) U149.VDD(VCC) U150.VDD(VCC) U151.VDD(VCC) U152.VDD(VCC) U153.VDD(VCC) U154.VDD(VCC) U155.VDD(VCC) U156.VDD(VCC) U157.VDD(VCC) U158.VDD(VCC) U159.VDD(VCC) U160.VDD(VCC) U161.VDD(VCC) U162.VDD(VCC) U163.VDD(VCC) U164.VDD(VCC) U165.VDD(VCC) U166.VDD(VCC) U167.VDD(VCC) U168.VDD(VCC) ; also sheet 1,2,3,4,5,7,8,9

## Sheet 7 of 9
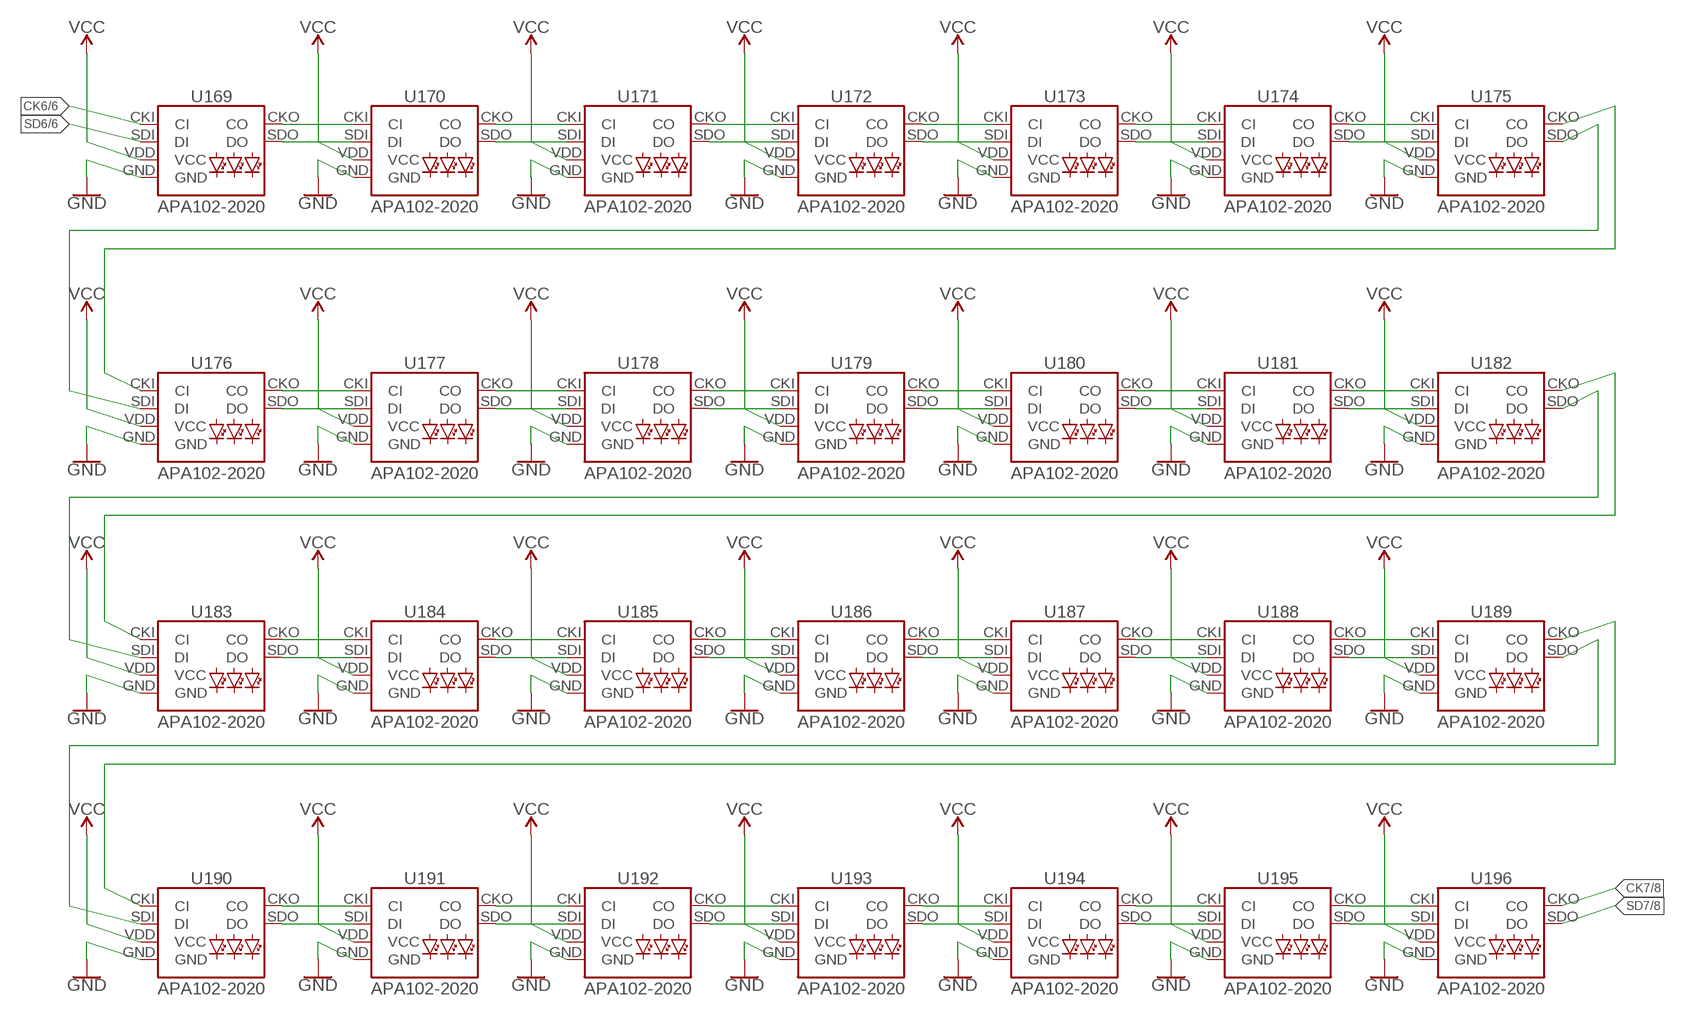
[diagram p6: schematic, sheet 7]

### Parts
U169  APA102-2020  [APA102-2020]
U170  APA102-2020  [APA102-2020]
U171  APA102-2020  [APA102-2020]
U172  APA102-2020  [APA102-2020]
U173  APA102-2020  [APA102-2020]
U174  APA102-2020  [APA102-2020]
U175  APA102-2020  [APA102-2020]
U176  APA102-2020  [APA102-2020]
U177  APA102-2020  [APA102-2020]
U178  APA102-2020  [APA102-2020]
U179  APA102-2020  [APA102-2020]
U180  APA102-2020  [APA102-2020]
U181  APA102-2020  [APA102-2020]
U182  APA102-2020  [APA102-2020]
U183  APA102-2020  [APA102-2020]
U184  APA102-2020  [APA102-2020]
U185  APA102-2020  [APA102-2020]
U186  APA102-2020  [APA102-2020]
U187  APA102-2020  [APA102-2020]
U188  APA102-2020  [APA102-2020]
U189  APA102-2020  [APA102-2020]
U190  APA102-2020  [APA102-2020]
U191  APA102-2020  [APA102-2020]
U192  APA102-2020  [APA102-2020]
U193  APA102-2020  [APA102-2020]
U194  APA102-2020  [APA102-2020]
U195  APA102-2020  [APA102-2020]
U196  APA102-2020  [APA102-2020]

### Nets
CK6: U169.CKI(CI) ; also sheet 6
CK7: U196.CKO(CO) ; also sheet 8
GND: U169.GND U170.GND U171.GND U172.GND U173.GND U174.GND U175.GND U176.GND U177.GND U178.GND U179.GND U180.GND U181.GND U182.GND U183.GND U184.GND U185.GND U186.GND U187.GND U188.GND U189.GND U190.GND U191.GND U192.GND U193.GND U194.GND U195.GND U196.GND ; also sheet 1,2,3,4,5,6,8,9
N$325: U169.SDO(DO) U170.SDI(DI)
N$326: U169.CKO(CO) U170.CKI(CI)
N$327: U170.CKO(CO) U171.CKI(CI)
N$328: U170.SDO(DO) U171.SDI(DI)
N$329: U171.SDO(DO) U172.SDI(DI)
N$330: U171.CKO(CO) U172.CKI(CI)
N$331: U172.CKO(CO) U173.CKI(CI)
N$332: U172.SDO(DO) U173.SDI(DI)
N$333: U173.CKO(CO) U174.CKI(CI)
N$334: U173.SDO(DO) U174.SDI(DI)
N$335: U174.CKO(CO) U175.CKI(CI)
N$336: U174.SDO(DO) U175.SDI(DI)
N$337: U176.SDO(DO) U177.SDI(DI)
N$338: U176.CKO(CO) U177.CKI(CI)
N$339: U177.CKO(CO) U178.CKI(CI)
N$340: U177.SDO(DO) U178.SDI(DI)
N$341: U178.SDO(DO) U179.SDI(DI)
N$342: U178.CKO(CO) U179.CKI(CI)
N$343: U179.CKO(CO) U180.CKI(CI)
N$344: U179.SDO(DO) U180.SDI(DI)
N$345: U180.CKO(CO) U181.CKI(CI)
N$346: U180.SDO(DO) U181.SDI(DI)
N$347: U181.CKO(CO) U182.CKI(CI)
N$348: U181.SDO(DO) U182.SDI(DI)
N$349: U175.SDO(DO) U176.SDI(DI)
N$350: U175.CKO(CO) U176.CKI(CI)
N$351: U183.SDO(DO) U184.SDI(DI)
N$352: U183.CKO(CO) U184.CKI(CI)
N$353: U184.CKO(CO) U185.CKI(CI)
N$354: U184.SDO(DO) U185.SDI(DI)
N$355: U185.SDO(DO) U186.SDI(DI)
N$356: U185.CKO(CO) U186.CKI(CI)
N$357: U186.CKO(CO) U187.CKI(CI)
N$358: U186.SDO(DO) U187.SDI(DI)
N$359: U187.CKO(CO) U188.CKI(CI)
N$360: U187.SDO(DO) U188.SDI(DI)
N$361: U188.CKO(CO) U189.CKI(CI)
N$362: U188.SDO(DO) U189.SDI(DI)
N$365: U190.SDO(DO) U191.SDI(DI)
N$366: U190.CKO(CO) U191.CKI(CI)
N$367: U191.CKO(CO) U192.CKI(CI)
N$368: U191.SDO(DO) U192.SDI(DI)
N$369: U192.SDO(DO) U193.SDI(DI)
N$370: U192.CKO(CO) U193.CKI(CI)
N$371: U193.CKO(CO) U194.CKI(CI)
N$372: U193.SDO(DO) U194.SDI(DI)
N$373: U194.CKO(CO) U195.CKI(CI)
N$374: U194.SDO(DO) U195.SDI(DI)
N$375: U189.SDO(DO) U190.SDI(DI)
N$376: U189.CKO(CO) U190.CKI(CI)
N$377: U182.SDO(DO) U183.SDI(DI)
N$378: U182.CKO(CO) U183.CKI(CI)
N$379: U195.CKO(CO) U196.CKI(CI)
N$380: U195.SDO(DO) U196.SDI(DI)
SD6: U169.SDI(DI) ; also sheet 6
SD7: U196.SDO(DO) ; also sheet 8
VCC: U169.VDD(VCC) U170.VDD(VCC) U171.VDD(VCC) U172.VDD(VCC) U173.VDD(VCC) U174.VDD(VCC) U175.VDD(VCC) U176.VDD(VCC) U177.VDD(VCC) U178.VDD(VCC) U179.VDD(VCC) U180.VDD(VCC) U181.VDD(VCC) U182.VDD(VCC) U183.VDD(VCC) U184.VDD(VCC) U185.VDD(VCC) U186.VDD(VCC) U187.VDD(VCC) U188.VDD(VCC) U189.VDD(VCC) U190.VDD(VCC) U191.VDD(VCC) U192.VDD(VCC) U193.VDD(VCC) U194.VDD(VCC) U195.VDD(VCC) U196.VDD(VCC) ; also sheet 1,2,3,4,5,6,8,9

## Sheet 8 of 9
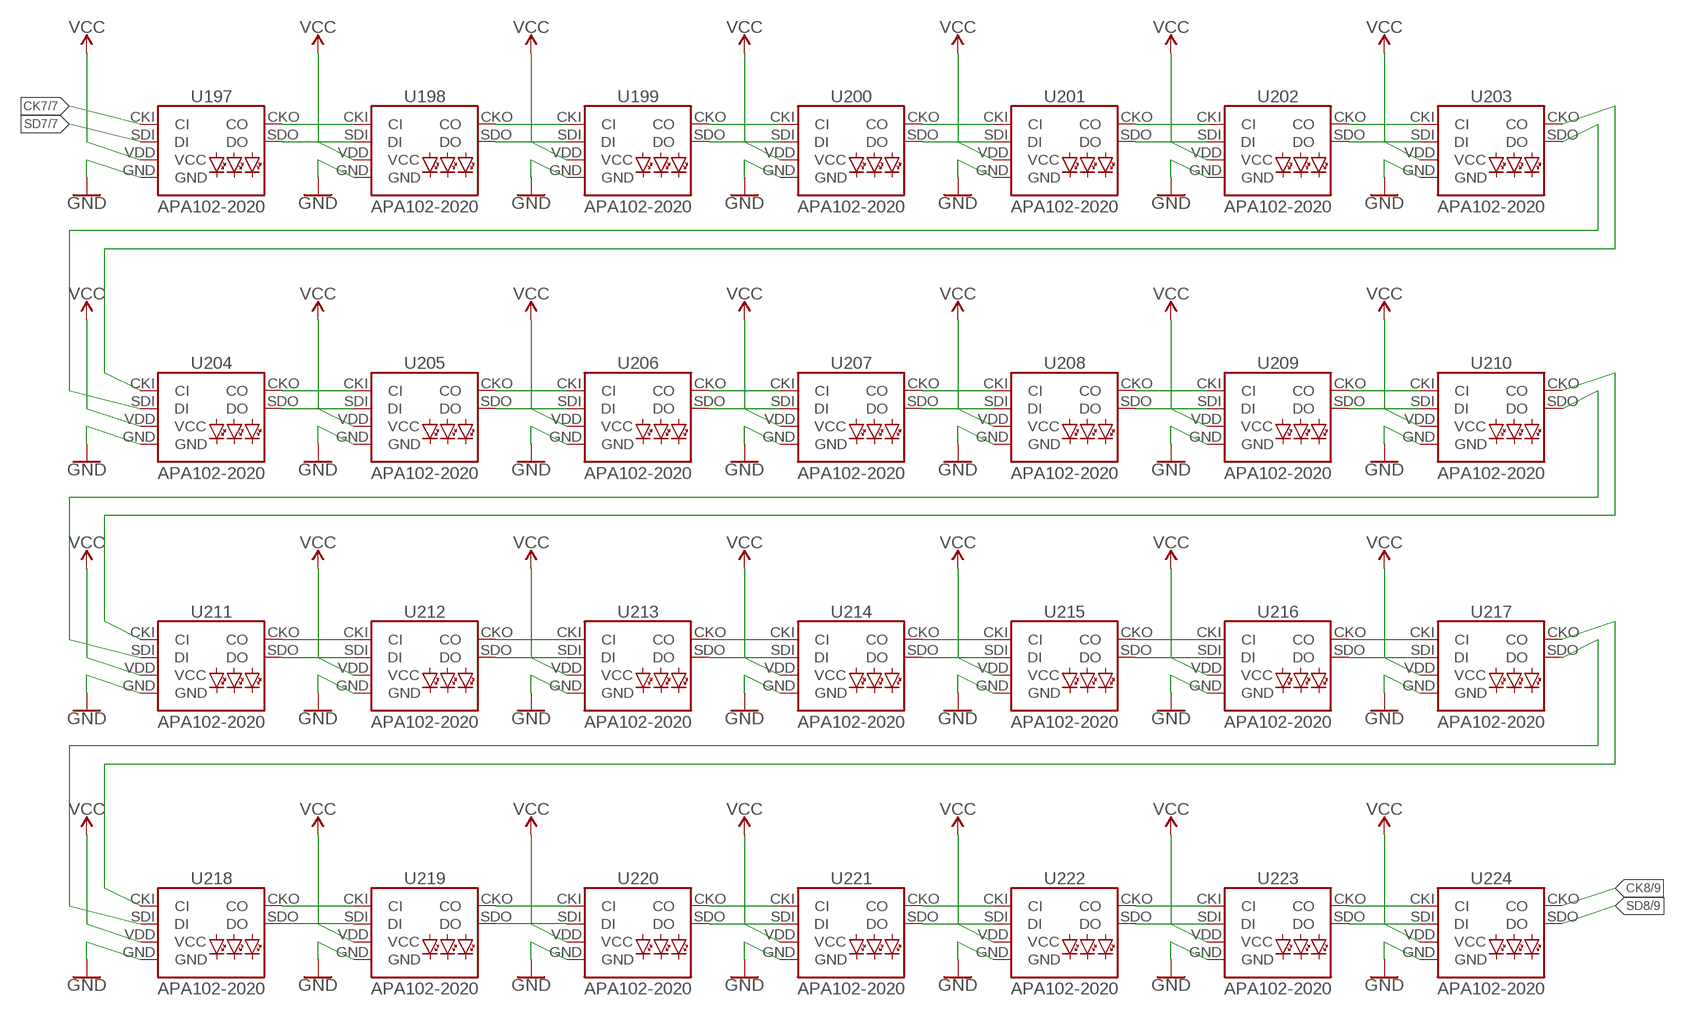
[diagram p7: schematic, sheet 8]

### Parts
U197  APA102-2020  [APA102-2020]
U198  APA102-2020  [APA102-2020]
U199  APA102-2020  [APA102-2020]
U200  APA102-2020  [APA102-2020]
U201  APA102-2020  [APA102-2020]
U202  APA102-2020  [APA102-2020]
U203  APA102-2020  [APA102-2020]
U204  APA102-2020  [APA102-2020]
U205  APA102-2020  [APA102-2020]
U206  APA102-2020  [APA102-2020]
U207  APA102-2020  [APA102-2020]
U208  APA102-2020  [APA102-2020]
U209  APA102-2020  [APA102-2020]
U210  APA102-2020  [APA102-2020]
U211  APA102-2020  [APA102-2020]
U212  APA102-2020  [APA102-2020]
U213  APA102-2020  [APA102-2020]
U214  APA102-2020  [APA102-2020]
U215  APA102-2020  [APA102-2020]
U216  APA102-2020  [APA102-2020]
U217  APA102-2020  [APA102-2020]
U218  APA102-2020  [APA102-2020]
U219  APA102-2020  [APA102-2020]
U220  APA102-2020  [APA102-2020]
U221  APA102-2020  [APA102-2020]
U222  APA102-2020  [APA102-2020]
U223  APA102-2020  [APA102-2020]
U224  APA102-2020  [APA102-2020]

### Nets
CK7: U197.CKI(CI) ; also sheet 7
CK8: U224.CKO(CO) ; also sheet 9
GND: U197.GND U198.GND U199.GND U200.GND U201.GND U202.GND U203.GND U204.GND U205.GND U206.GND U207.GND U208.GND U209.GND U210.GND U211.GND U212.GND U213.GND U214.GND U215.GND U216.GND U217.GND U218.GND U219.GND U220.GND U221.GND U222.GND U223.GND U224.GND ; also sheet 1,2,3,4,5,6,7,9
N$381: U197.SDO(DO) U198.SDI(DI)
N$382: U197.CKO(CO) U198.CKI(CI)
N$383: U198.CKO(CO) U199.CKI(CI)
N$384: U198.SDO(DO) U199.SDI(DI)
N$385: U199.SDO(DO) U200.SDI(DI)
N$386: U199.CKO(CO) U200.CKI(CI)
N$387: U200.CKO(CO) U201.CKI(CI)
N$388: U200.SDO(DO) U201.SDI(DI)
N$389: U201.CKO(CO) U202.CKI(CI)
N$390: U201.SDO(DO) U202.SDI(DI)
N$391: U202.CKO(CO) U203.CKI(CI)
N$392: U202.SDO(DO) U203.SDI(DI)
N$393: U204.SDO(DO) U205.SDI(DI)
N$394: U204.CKO(CO) U205.CKI(CI)
N$395: U205.CKO(CO) U206.CKI(CI)
N$396: U205.SDO(DO) U206.SDI(DI)
N$397: U206.SDO(DO) U207.SDI(DI)
N$398: U206.CKO(CO) U207.CKI(CI)
N$399: U207.CKO(CO) U208.CKI(CI)
N$400: U207.SDO(DO) U208.SDI(DI)
N$401: U208.CKO(CO) U209.CKI(CI)
N$402: U208.SDO(DO) U209.SDI(DI)
N$403: U209.CKO(CO) U210.CKI(CI)
N$404: U209.SDO(DO) U210.SDI(DI)
N$405: U203.SDO(DO) U204.SDI(DI)
N$406: U203.CKO(CO) U204.CKI(CI)
N$407: U211.SDO(DO) U212.SDI(DI)
N$408: U211.CKO(CO) U212.CKI(CI)
N$409: U212.CKO(CO) U213.CKI(CI)
N$410: U212.SDO(DO) U213.SDI(DI)
N$411: U213.SDO(DO) U214.SDI(DI)
N$412: U213.CKO(CO) U214.CKI(CI)
N$413: U214.CKO(CO) U215.CKI(CI)
N$414: U214.SDO(DO) U215.SDI(DI)
N$415: U215.CKO(CO) U216.CKI(CI)
N$416: U215.SDO(DO) U216.SDI(DI)
N$417: U216.CKO(CO) U217.CKI(CI)
N$418: U216.SDO(DO) U217.SDI(DI)
N$419: U217.SDO(DO) U218.SDI(DI)
N$420: U217.CKO(CO) U218.CKI(CI)
N$421: U210.SDO(DO) U211.SDI(DI)
N$422: U210.CKO(CO) U211.CKI(CI)
N$423: U218.CKO(CO) U219.CKI(CI)
N$424: U218.SDO(DO) U219.SDI(DI)
N$425: U219.CKO(CO) U220.CKI(CI)
N$426: U219.SDO(DO) U220.SDI(DI)
N$427: U220.SDO(DO) U221.SDI(DI)
N$428: U220.CKO(CO) U221.CKI(CI)
N$429: U221.CKO(CO) U222.CKI(CI)
N$430: U221.SDO(DO) U222.SDI(DI)
N$431: U222.CKO(CO) U223.CKI(CI)
N$432: U222.SDO(DO) U223.SDI(DI)
N$433: U223.CKO(CO) U224.CKI(CI)
N$434: U223.SDO(DO) U224.SDI(DI)
SD7: U197.SDI(DI) ; also sheet 7
SD8: U224.SDO(DO) ; also sheet 9
VCC: U197.VDD(VCC) U198.VDD(VCC) U199.VDD(VCC) U200.VDD(VCC) U201.VDD(VCC) U202.VDD(VCC) U203.VDD(VCC) U204.VDD(VCC) U205.VDD(VCC) U206.VDD(VCC) U207.VDD(VCC) U208.VDD(VCC) U209.VDD(VCC) U210.VDD(VCC) U211.VDD(VCC) U212.VDD(VCC) U213.VDD(VCC) U214.VDD(VCC) U215.VDD(VCC) U216.VDD(VCC) U217.VDD(VCC) U218.VDD(VCC) U219.VDD(VCC) U220.VDD(VCC) U221.VDD(VCC) U222.VDD(VCC) U223.VDD(VCC) U224.VDD(VCC) ; also sheet 1,2,3,4,5,6,7,9

## Sheet 9 of 9
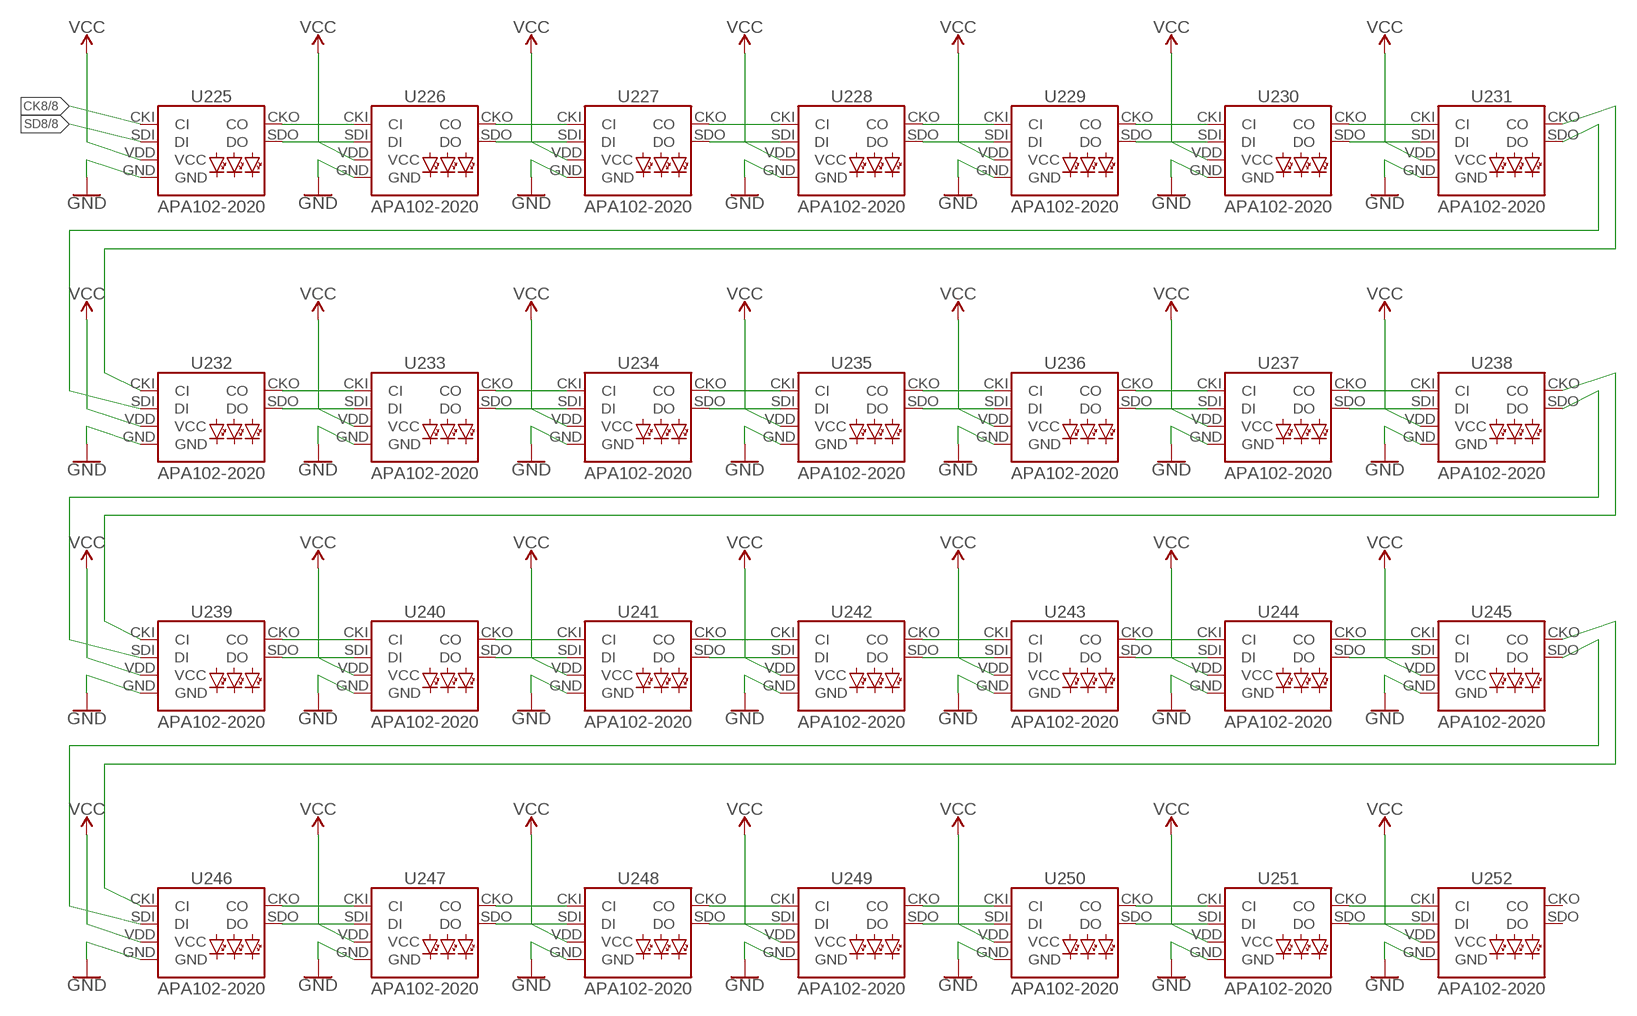
[diagram p8: schematic, sheet 9]

### Parts
U225  APA102-2020  [APA102-2020]
U226  APA102-2020  [APA102-2020]
U227  APA102-2020  [APA102-2020]
U228  APA102-2020  [APA102-2020]
U229  APA102-2020  [APA102-2020]
U230  APA102-2020  [APA102-2020]
U231  APA102-2020  [APA102-2020]
U232  APA102-2020  [APA102-2020]
U233  APA102-2020  [APA102-2020]
U234  APA102-2020  [APA102-2020]
U235  APA102-2020  [APA102-2020]
U236  APA102-2020  [APA102-2020]
U237  APA102-2020  [APA102-2020]
U238  APA102-2020  [APA102-2020]
U239  APA102-2020  [APA102-2020]
U240  APA102-2020  [APA102-2020]
U241  APA102-2020  [APA102-2020]
U242  APA102-2020  [APA102-2020]
U243  APA102-2020  [APA102-2020]
U244  APA102-2020  [APA102-2020]
U245  APA102-2020  [APA102-2020]
U246  APA102-2020  [APA102-2020]
U247  APA102-2020  [APA102-2020]
U248  APA102-2020  [APA102-2020]
U249  APA102-2020  [APA102-2020]
U250  APA102-2020  [APA102-2020]
U251  APA102-2020  [APA102-2020]
U252  APA102-2020  [APA102-2020]

### Nets
CK8: U225.CKI(CI) ; also sheet 8
GND: U225.GND U226.GND U227.GND U228.GND U229.GND U230.GND U231.GND U232.GND U233.GND U234.GND U235.GND U236.GND U237.GND U238.GND U239.GND U240.GND U241.GND U242.GND U243.GND U244.GND U245.GND U246.GND U247.GND U248.GND U249.GND U250.GND U251.GND U252.GND ; also sheet 1,2,3,4,5,6,7,8
N$435: U225.SDO(DO) U226.SDI(DI)
N$436: U225.CKO(CO) U226.CKI(CI)
N$437: U226.CKO(CO) U227.CKI(CI)
N$438: U226.SDO(DO) U227.SDI(DI)
N$439: U227.SDO(DO) U228.SDI(DI)
N$440: U227.CKO(CO) U228.CKI(CI)
N$441: U228.CKO(CO) U229.CKI(CI)
N$442: U228.SDO(DO) U229.SDI(DI)
N$443: U229.CKO(CO) U230.CKI(CI)
N$444: U229.SDO(DO) U230.SDI(DI)
N$445: U230.CKO(CO) U231.CKI(CI)
N$446: U230.SDO(DO) U231.SDI(DI)
N$447: U232.SDO(DO) U233.SDI(DI)
N$448: U232.CKO(CO) U233.CKI(CI)
N$449: U233.CKO(CO) U234.CKI(CI)
N$450: U233.SDO(DO) U234.SDI(DI)
N$451: U234.SDO(DO) U235.SDI(DI)
N$452: U234.CKO(CO) U235.CKI(CI)
N$453: U235.CKO(CO) U236.CKI(CI)
N$454: U235.SDO(DO) U236.SDI(DI)
N$455: U236.CKO(CO) U237.CKI(CI)
N$456: U236.SDO(DO) U237.SDI(DI)
N$457: U237.CKO(CO) U238.CKI(CI)
N$458: U237.SDO(DO) U238.SDI(DI)
N$459: U231.SDO(DO) U232.SDI(DI)
N$460: U231.CKO(CO) U232.CKI(CI)
N$461: U239.SDO(DO) U240.SDI(DI)
N$462: U239.CKO(CO) U240.CKI(CI)
N$463: U240.CKO(CO) U241.CKI(CI)
N$464: U240.SDO(DO) U241.SDI(DI)
N$465: U241.SDO(DO) U242.SDI(DI)
N$466: U241.CKO(CO) U242.CKI(CI)
N$467: U242.CKO(CO) U243.CKI(CI)
N$468: U242.SDO(DO) U243.SDI(DI)
N$469: U243.CKO(CO) U244.CKI(CI)
N$470: U243.SDO(DO) U244.SDI(DI)
N$471: U244.CKO(CO) U245.CKI(CI)
N$472: U244.SDO(DO) U245.SDI(DI)
N$473: U245.SDO(DO) U246.SDI(DI)
N$474: U245.CKO(CO) U246.CKI(CI)
N$475: U238.SDO(DO) U239.SDI(DI)
N$476: U238.CKO(CO) U239.CKI(CI)
N$477: U246.CKO(CO) U247.CKI(CI)
N$478: U246.SDO(DO) U247.SDI(DI)
N$479: U247.CKO(CO) U248.CKI(CI)
N$480: U247.SDO(DO) U248.SDI(DI)
N$481: U248.SDO(DO) U249.SDI(DI)
N$482: U248.CKO(CO) U249.CKI(CI)
N$483: U249.CKO(CO) U250.CKI(CI)
N$484: U249.SDO(DO) U250.SDI(DI)
N$485: U250.CKO(CO) U251.CKI(CI)
N$486: U250.SDO(DO) U251.SDI(DI)
N$487: U251.CKO(CO) U252.CKI(CI)
N$488: U251.SDO(DO) U252.SDI(DI)
SD8: U225.SDI(DI) ; also sheet 8
VCC: U225.VDD(VCC) U226.VDD(VCC) U227.VDD(VCC) U228.VDD(VCC) U229.VDD(VCC) U230.VDD(VCC) U231.VDD(VCC) U232.VDD(VCC) U233.VDD(VCC) U234.VDD(VCC) U235.VDD(VCC) U236.VDD(VCC) U237.VDD(VCC) U238.VDD(VCC) U239.VDD(VCC) U240.VDD(VCC) U241.VDD(VCC) U242.VDD(VCC) U243.VDD(VCC) U244.VDD(VCC) U245.VDD(VCC) U246.VDD(VCC) U247.VDD(VCC) U248.VDD(VCC) U249.VDD(VCC) U250.VDD(VCC) U251.VDD(VCC) U252.VDD(VCC) ; also sheet 1,2,3,4,5,6,7,8
Unconnected: U252.CKO(CO) U252.SDO(DO)

## Library data of the parts
FD1 FD2 = SparkFun-Aesthetics:FIDUCIAL: Fiducial Alignment Points Point-of-reference for pick-and-place machines and other optical instruments.
J1 J2 = SparkFun-Connectors:QWIIC_CONNECTOR: SparkFun I2C Standard Qwiic Connector An SMD 1mm pitch JST connector makes it easy and quick (get it? Qwiic?) to connect I2C devices to each other. The Qwiic system <http://www.sparkfun.com/qwiic> enables fast and solderless connection between popular platforms and various sensors and actuators. We carry 200mm <https://www.sparkfun.com/products/14204>, 100mm <https://www.sparkfun.com/products/14205>, 50mm <https://www.sparkfun.com/products/14206>, and breadboard friendly <https://www.sparkfun.com/products/14207> Qwiic cables. We also offer 10 pcs strips <https://www.sparkfun.com/products/14323> the SMD connectors.; PROD_ID: CONN-13694
U1-U252 = SparkFun-LED:APA102: APA102 Addressable RGB LED Used in manufacturing of various products at SparkFun Packages: 5050 2020 SparkFun Products: SparkFun Lumenati Boards <https://www.sparkfun.com/categories/405>; PROD_ID: DIO-13883